# EAGLE schematic siren (EAGLE 9.5.2)
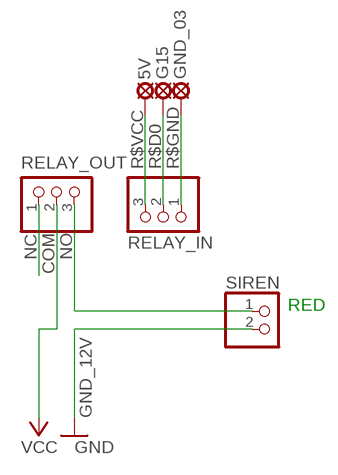
[diagram p0: schematic, sheet 1]

## Parts
5V  MCS08  [MCS08]
G15  MCS08  [MCS08]
GND_03  MCS08  [MCS08]
RELAY_IN  PINHD-1X3  [1X03]
RELAY_OUT  PINHD-1X3  [1X03]
SIREN  PINHD-1X2  [1X02]

## Nets
COM: RELAY_OUT.2 ; supply symbol labelled VCC
GND_12V: SIREN.2 ; supply symbol labelled GND
NC: RELAY_OUT.1
NO: RELAY_OUT.3 SIREN.1
R$D0: G15.MP RELAY_IN.2
R$GND: GND_03.MP RELAY_IN.1
R$VCC: 5V.MP RELAY_IN.3

## Notes on the sheet
- RED

## Library data of the parts
5V G15 GND_03 = solpad:MCS08: SOLDER PAD MC S0,8, drill 1.2 mm, distributor Buerklin, 08F130
RELAY_IN RELAY_OUT = pinhead:PINHD-1X3: PIN HEADER
SIREN = pinhead:PINHD-1X2: PIN HEADER